# Altium schematic sheet CAN.SchDoc
size A
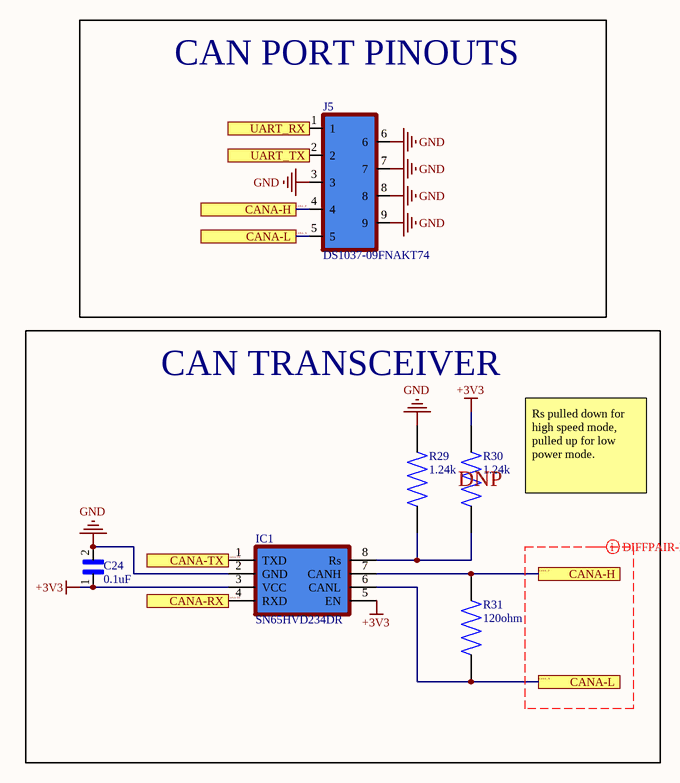
[diagram p0: CAN.SchDoc]

## Parts
C24  0.1uF  [CAP 0805(2012 metric)]
IC1  SN65HVD234DR  [SN65HVD234DR]
J5  DS1037-09FNAKT74  [DSUB CONN 9 POS]
R29  1.24k  [RES 0805(2012 metric)]
R30  1.24k  [RES 0805(2012 metric)]
R31  120ohm  [RES 0805(2012 metric)]

## Blocks framed on the sheet
CAN PORT PINOUTS: J5
CAN TRANSCEIVER: C24 IC1 R29-R31

## Ports
CANA-H, CANA-L, CANA-RX, CANA-TX, UART_RX, UART_TX

## Nets
+3V3: C24.1 IC1.3(VCC) IC1.5(EN) R30.2
GND: C24.2 IC1.2(GND) J5.3 J5.6 J5.7 J5.8 J5.9 R29.2
CANA-RX: IC1.4(RXD) ; port CANA-RX
CANA-TX: IC1.1(TXD) ; port CANA-TX
CANA_N: IC1.6(CANL) J5.5 R31.1 ; port CANA-L
CANA_P: IC1.7(CANH) J5.4 R31.2 ; port CANA-H
UART_RX: J5.1 ; port UART_RX
UART_TX: J5.2 ; port UART_TX
NetIC1_8: IC1.8(Rs) R29.1 R30.1

## Layout directives
differential pair; differential pair class DIFF90: CANA_N, CANA_P

## Notes on the sheet
- (near R30) DNP
- Rs pulled down for high speed mode, pulled up for low power mode.

## Library data of the parts
C24 = 0.1uF 25V 0805: 0.1µF ±10% 25V Ceramic Capacitor X7R 0805 (2012Metric)
J5 = DSBU CONN 9 POS
R29 R30 = 1.24k 0805
R31 = 120ohm 0805: 120 Ohms ±5% 0.1W, 1/10W Chip Resistor 0805 (2012 Metric) Moisture Resistant Thick Film